# EAGLE design AttinyProgrammer (EAGLE 9.4.1)
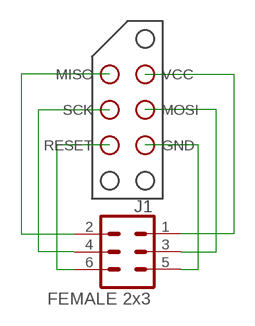
[diagram p0: schematic, sheet 1]

## Parts
J1  FEMALE 2x3  CONN_03X2FEMALE  [2X3]
U$1  PROGRAMMING-PORTJIG  [PROGRAMMING-JIG]

## Nets
N$1: J1.6 U$1.P$5(RESET)
N$2: J1.4 U$1.P$3(SCK)
N$3: J1.2 U$1.P$1(MISO)
N$4: J1.5 U$1.P$6(GND)
N$5: J1.3 U$1.P$4(MOSI)
N$6: J1.1 U$1.P$2(VCC)

## Library data of the parts
J1 = SparkFun-Connectors:CONN_03X2: Multi connection point. Often used as Generic Header-pin footprint for 0.1 inch spaced/style header connections You can populate with any combo of single row headers, but if you'd like an exact match, check these: Header - 2x3 (Male, 0.1") <https://www.sparkfun.com/products/12807> (PRT-12807) Header - 2x3 (Female, 0.1") <https://www.sparkfun.com/products/13010> (PRT-13010) 2x3 Pin Shrouded Header <https://www.sparkfun.com/products/10877> (PRT-10877) On any of the 0.1 inch spaced packages, you can populate with these: Break Away Headers - Straight <https://www.sparkfun.com/products/116> (PRT-00116) Break Away Male Headers - Right Angle <https://www.sparkfun.com/products/553> (PRT-00553) Female Headers <https://www.sparkfun.com/products/115> (PRT-00115) Break Away Headers - Machine Pin <https://www.sparkfun.com/products/117> (PRT-00117) Break Away Female Headers - Swiss Machine Pin <https://www.sparkfun.com/products/743> (PRT-00743) Special note: the shrouded connector mates well with our 3x2 ribbon cables: Ribbon Crimp Connector - 6-pin (2x3, Female) <https://www.sparkfun.com/products/10651> (PRT-10651) Ribbon Cable - 6 wire (15ft) <https://www.sparkfun.com/products/10646> (PRT-10646); PROD_ID: CONN-11566
U$1 = ATTINY85-20SU:PROGRAMMING-PORT

## Board
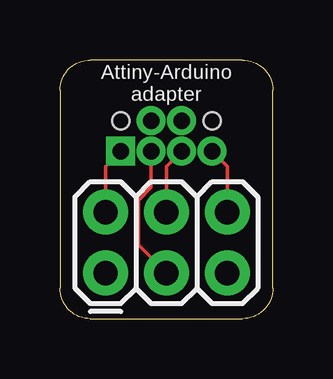
[diagram p1: board, top side]
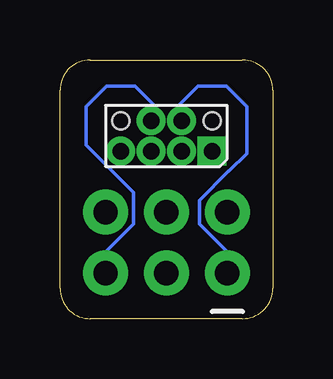
[diagram p2: board, bottom side, seen from below]

Size 8.89 x 10.79 mm. Coordinates in mm from the lower left corner, seen from the top.
Outline: 1.27,0 7.62,0 arc90 8.89,1.27 8.89,9.53 arc90 7.62,10.79 1.27,10.79 arc90 0,9.53 0,1.27 arc90 1.27,0
Copper layers (1*16): Top 0.035mm / dielectric 1.5mm / Bottom 0.035mm
Design rules "default": minimum track width 6mil, minimum drill 0.35mm, track to track 6mil, track to pad 6mil, pad to pad 6mil, via to via 6mil, smd to smd 6mil, copper to edge 40mil, drill to drill 6mil, minimum pad ring 10mil, minimum via ring 8mil, stop-mask expansion 4mil, vias tented up to drill 0mil, thermal gap 10mil

### Footprints (pad centres in the part's own frame; a part is rotated, then mirrored left to right if it is on the bottom)
2X3 = drill 1.016 pad 1.88: 1 0,0; 2 0,2.54; 3 2.54,0; 4 2.54,2.54; 5 5.08,0; 6 5.08,2.54
PROGRAMMING-JIG = drill 0.7 pad 1.016 square: P$1 -1.905,-0.635 | drill 0.7 pad 1.016: P$2 -0.635,0.635; P$3 0.635,-0.635; P$4 -0.635,-0.635; P$5 1.905,-0.635; P$6 0.635,0.635 | hole 0.7: -1.905,0.635; 1.905,0.635

### Placement (x,y rotation side)
J1  1.91,1.91 0 top
U$1  4.45,7.62 0 top

### Tracks (layer width: path | path; a pad name or v marks a point on that pad's centre or on a via)
N$1
  Top 0.152: J1.6 6.99,6.35 6.52,6.81 6.35,6.81 U$1.P$5
N$2
  Top 0.152: J1.4 4.45,6.35 U$1.P$3
N$3
  Top 0.152: J1.2 1.91,6.35 2.37,6.81 2.54,6.81 U$1.P$1
N$4
  Bottom 0.152: J1.5 6.99,2.79 5.82,3.96 5.82,5.27 7.79,7.25 7.79,8.85 6.95,9.7 5.75,9.7 4.91,8.85 4.91,8.26 U$1.P$6
N$5
  Top 0.152: U$1.P$4 3.81,5.46 3.28,4.93 3.28,3.07 J1.3
N$6
  Bottom 0.152: J1.1 1.91,2.79 3.07,3.96 3.07,4.93 1.85,6.15 1.84,6.15 1.1,6.9 1.1,8.85 1.94,9.7 3.14,9.7 3.98,8.85 3.98,8.26 U$1.P$2

### Text on the board
tNames: Attiny-Arduino / adapter